# EAGLE design controller (EAGLE 6.5.0)
DATABASE: $HOME/Documents/eagle/bom-ex_database.txt
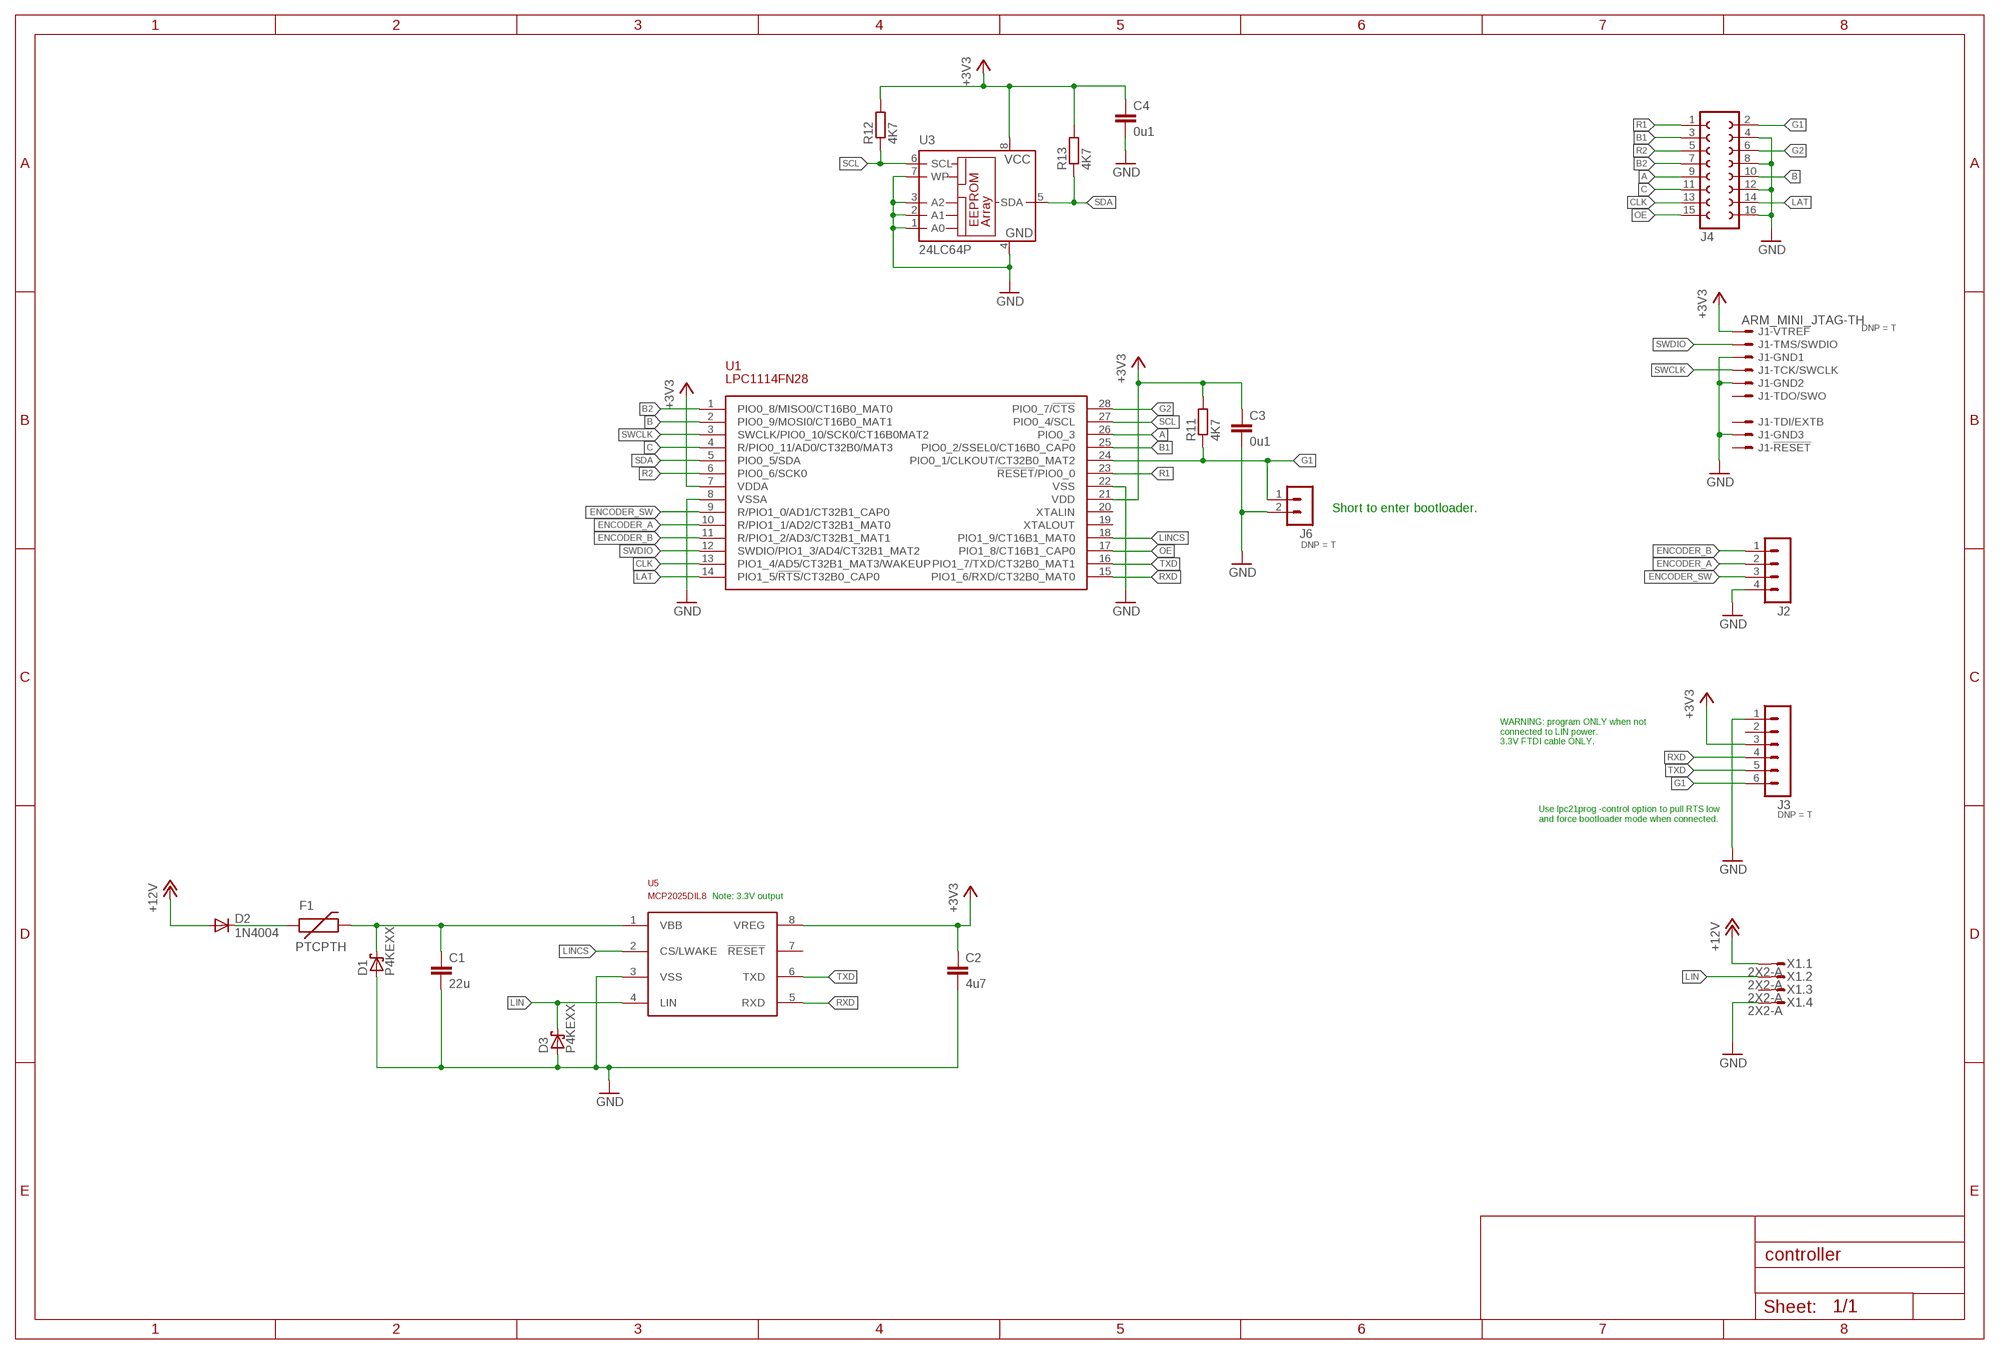
[diagram p0: schematic, sheet 1]

## Parts
C1  22u  C-EU050-024X044  [C050-024X044]
C2  4u7  C-EU050-024X044  [C050-024X044]
C3  0u1  C-EU050-024X044  [C050-024X044]
C4  0u1  C-EU050-024X044  [C050-024X044]
D1  P4KEXX  [DO41-10]
D2  1N4004  [DO41-10]
D3  P4KEXX  [DO41-10]
F1  PTCPTH  [PTC]
J1  ARM_MINI_JTAG-TH  [FTSH-105-01-XXX-DV]
J2  MA04-1  [MA04-1]
J3  MA06-1  [MA06-1]
J4  FE08-2  [FE08-2]
J6  MA02-1Y  [MA02-1Y]
R11  4K7  R-EU_0207/10  [0207/10]
R12  4K7  R-EU_0207/10  [0207/10]
R13  4K7  R-EU_0207/10  [0207/10]
U1  LPC1114FN28  [DIL28]
U3  24LC64P  [DIL8]
U5  MCP2025DIL8  [DIL8]
X1  2X2-A  [3-794618-4]

## Nets
+3V3 [power]: C2.1 C3.1 C4.1 J1.1 J3.3 R11.2 R12.2 R13.2 U1.7(VDDA) U1.21(VDD) U3.8(VCC) U5.8(VREG)
+12V [big_power]: D2.A X1.1
A: J4.9 U1.26(PIO0_3)
B: J4.10 U1.2(PIO0_9/MOSI0/CT16B0_MAT1)
B1: J4.3 U1.25(PIO0_2/SSEL0/CT16B0_CAP0)
B2: J4.7 U1.1(PIO0_8/MISO0/CT16B0_MAT0)
C: J4.11 U1.4(R/PIO0_11/AD0/CT32B0/MAT3)
CLK: J4.13 U1.13(PIO1_4/AD5/CT32B1_MAT3/WAKEUP)
ENCODER_A: J2.2 U1.10(R/PIO1_1/AD2/CT32B1_MAT0)
ENCODER_B: J2.1 U1.11(R/PIO1_2/AD3/CT32B1_MAT1)
ENCODER_SW: J2.3 U1.9(R/PIO1_0/AD1/CT32B1_CAP0)
G1: J3.6 J4.2 J6.1 R11.1 U1.24(PIO0_1/CLKOUT/CT32B0_MAT2)
G2: J4.6 U1.28(PIO0_7/!CTS)
GND [power]: C1.2 C2.2 C3.2 C4.2 D1.A D3.A J1.3 J1.5 J1.9 J2.4 J3.1 J4.4 J4.8 J4.12 J4.16 J6.2 U1.8(VSSA) U1.22(VSS) U3.1(A0) U3.2(A1) U3.3(A2) U3.4(GND) U3.7(WP) U5.3(VSS) X1.4
LAT: J4.14 U1.14(PIO1_5/!RTS!/CT32B0_CAP0)
LIN: D3.C U5.4(LIN) X1.2
LINCS: U1.18(PIO1_9/CT16B1_MAT0) U5.2(CS/LWAKE)
N$1 [big_power]: C1.1 D1.C F1.P$2 U5.1(VBB)
N$2 [big_power]: D2.C F1.P$1
OE: J4.15 U1.17(PIO1_8/CT16B1_CAP0)
R1: J4.1 U1.23(!RESET!/PIO0_0)
R2: J4.5 U1.6(PIO0_6/SCK0)
RXD: J3.4 U1.15(PIO1_6/RXD/CT32B0_MAT0) U5.5(RXD)
SCL: R12.1 U1.27(PIO0_4/SCL) U3.6(SCL)
SDA: R13.1 U1.5(PIO0_5/SDA) U3.5(SDA)
SWCLK: J1.4 U1.3(SWCLK/PIO0_10/SCK0/CT16B0MAT2)
SWDIO: J1.2 U1.12(SWDIO/PIO1_3/AD4/CT32B1_MAT2)
TXD: J3.5 U1.16(PIO1_7/TXD/CT32B0_MAT1) U5.6(TXD)
Unconnected: J1.6 J1.8 J1.10 J3.2 U1.19(XTALOUT) U1.20(XTALIN) U5.7(!RESET) X1.3

## Notes on the sheet
- Short to enter bootloader.
- WARNING: program ONLY when not
  connected to LIN power.
  3.3V FTDI cable ONLY.
- Use lpc21prog -control option to pull RTS low
  and force bootloader mode when connected.
- Note: 3.3V output

## Library data of the parts
C1 = custom:C-EU: CAPACITOR, European symbol; PARTNO: FK22X5R1E226M
C2 = custom:C-EU: CAPACITOR, European symbol; PARTNO: FK28X5R0J475K
C3 C4 = custom:C-EU: CAPACITOR, European symbol; PARTNO: FK28X7R1H104K
D1 D3 = custom:P4KEXX: DIODE transient-voltage suppressor; PARTNO: P4KE30CA
D2 = custom:1N4004: DIODE general purpose rectifier, 1 A; PARTNO: 1N4004-TP
F1 = custom:PTC: Resettable Fuse PTC Resettable Fuse. Spark Fun Electronics SKU : COM-08357; PARTNO: CMF-RL10-0
J1 = custom:ARM_MINI_JTAG: CONNECTOR wire to board 1.25 mm (.049 inch) pitch header; DNP: T; PARTNO: *
J2 = custom:MA04-1: PIN HEADER; OC_FARNELL: unknown; OC_NEWARK: unknown; PARTNO: 640454-4
J3 = custom:MA06-1: PIN HEADER; DNP: T; OC_FARNELL: unknown; OC_NEWARK: unknown; PARTNO: *
J4 = custom:FE08-2: FEMALE HEADER; OC_FARNELL: unknown; OC_NEWARK: unknown; PARTNO: PPTC082LFBN-RC
J6 = custom:MA02-1: PIN HEADER; DNP: T
R11-R13 = custom:R-EU_: RESISTOR, European symbol; PARTNO: MFR-25FBF52-4K99
U1 = custom:LPC1114FN28: ARM Cortex-M0+ in 28-pin DIP; PARTNO: LPC1114FN28/102,12
U3 = custom:24*: Serial EEPROM I2C; MF: MICROCHIP; MPN: 24LC64-I/P; OC_FARNELL: 9758054; OC_NEWARK: 62K0584; PARTNO: 24LC64-I/P
U5 = custom:MCP2025: LIN Transceiver with Voltage Regulator; PARTNO: MCP2025-330E/P
X1 = custom:2X2; PARTNO: 3-794618-4

## Net classes
0 default: width 0.254 mm, drill 0.508 mm
1 power: width 0.635 mm, drill 0.508 mm
2 big_power: width 1.27 mm, clearance 0.508 mm

## Board
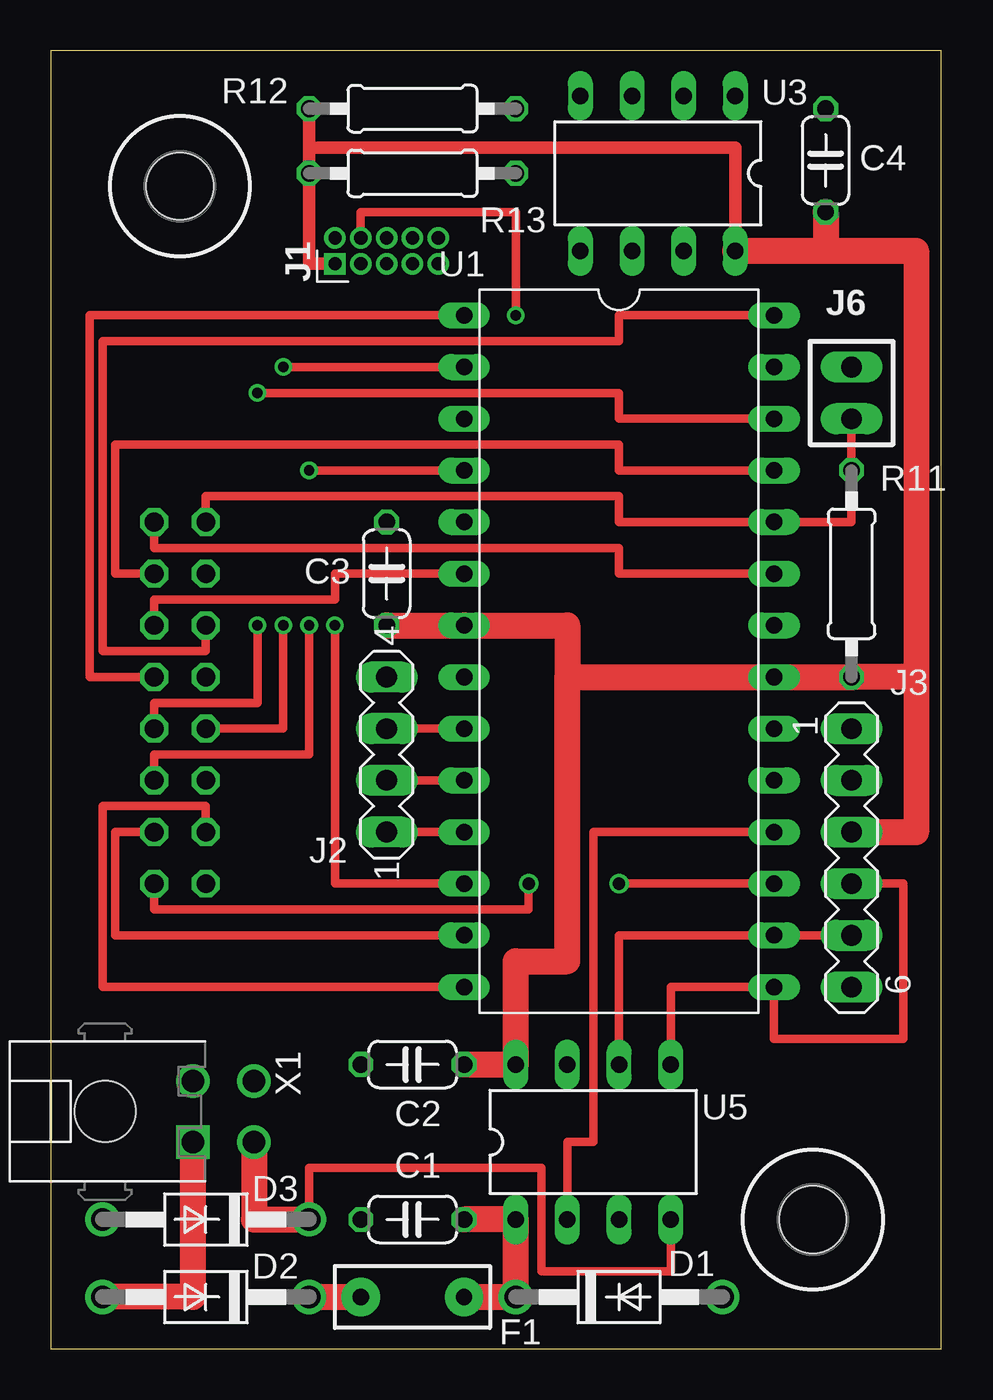
[diagram p1: board, top side]
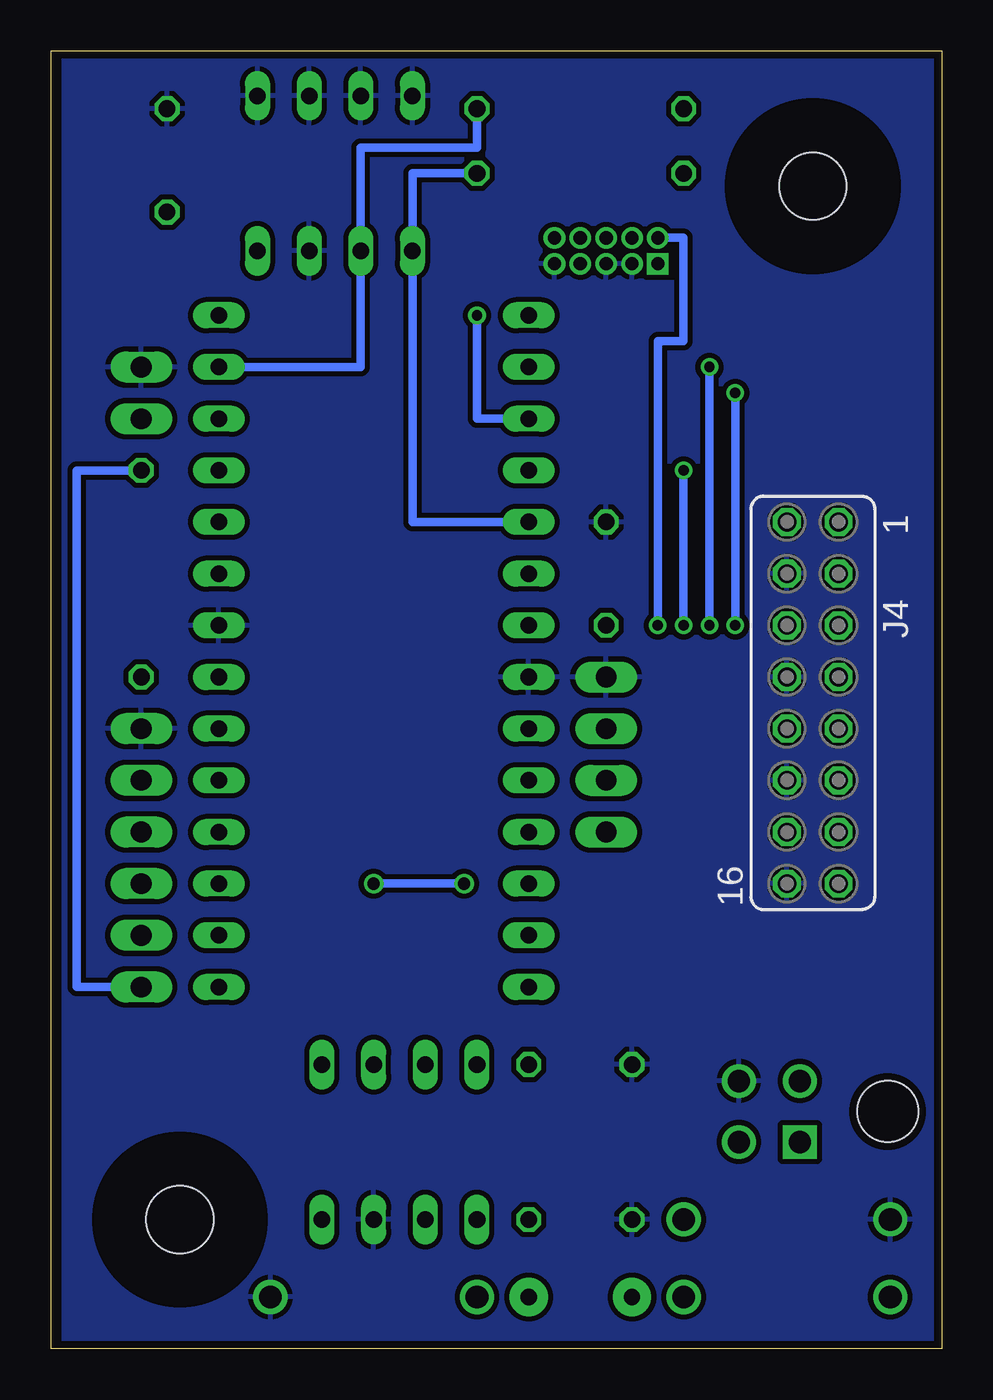
[diagram p2: board, bottom side, seen from below]

Size 43.8 x 63.8 mm. Coordinates in mm from the lower left corner, seen from the top.
Outline: 0,0 43.8,0 43.8,63.8 0,63.8 0,0
Copper layers (1*16): Top 0.0356mm / dielectric 1.5011mm / Bottom 0.0356mm
Design rules "LaenPCBOrder": minimum track width 6mil, minimum drill 13mil, track to track 6mil, track to pad 6mil, pad to pad 6mil, via to via 6mil, smd to smd 6mil, copper to edge 15mil, drill to drill 6mil, minimum pad ring 7mil, minimum via ring 7mil, stop-mask expansion 3mil, vias tented up to drill 0mil, thermal gap 10mil

### Footprints (pad centres in the part's own frame; a part is rotated, then mirrored left to right if it is on the bottom)
C050-024X044 = drill 0.813 octagon: 1 -2.54,0; 2 2.54,0
DO41-10 = drill 1.118: A 5.08,0; C -5.08,0
PTC = drill 0.8 pad 1.88: P$1 -2.54,0; P$2 2.54,0
FTSH-105-01-XXX-DV = drill 0.65 pad 1.06 square: 1 0,0 | drill 0.65 pad 1.06: 2 0,1.27; 3 1.27,0; 4 1.27,1.27; 5 2.54,0; 6 2.54,1.27; 7 3.81,0; 8 3.81,1.27; 9 5.08,0; 10 5.08,1.27
MA04-1 = drill 1.016 long: 1 -3.81,0; 2 -1.27,0; 3 1.27,0; 4 3.81,0
MA06-1 = drill 1.016 long: 1 -6.35,0; 2 -3.81,0; 3 -1.27,0; 4 1.27,0; 5 3.81,0; 6 6.35,0
FE08-2 = drill 0.914 octagon: 1 -8.89,1.27; 2 -8.89,-1.27; 3 -6.35,1.27; 4 -6.35,-1.27; 5 -3.81,1.27; 6 -3.81,-1.27; 7 -1.27,1.27; 8 -1.27,-1.27; 9 1.27,1.27; 10 1.27,-1.27; 11 3.81,1.27; 12 3.81,-1.27; 13 6.35,1.27; 14 6.35,-1.27; 15 8.89,1.27; 16 8.89,-1.27
MA02-1Y = drill 1.016 long: 1 -1.27,0; 2 1.27,0
0207/10 = drill 0.813 octagon: 1 -5.08,0; 2 5.08,0
DIL28 = drill 0.813 pad 1.27 long: 1 -16.51,-7.62; 2 -13.97,-7.62; 3 -11.43,-7.62; 4 -8.89,-7.62; 5 -6.35,-7.62; 6 -3.81,-7.62; 7 -1.27,-7.62; 8 1.27,-7.62; 9 3.81,-7.62; 10 6.35,-7.62; 11 8.89,-7.62; 12 11.43,-7.62; 13 13.97,-7.62; 14 16.51,-7.62; 15 16.51,7.62; 16 13.97,7.62; 17 11.43,7.62; 18 8.89,7.62; 19 6.35,7.62; 20 3.81,7.62; 21 1.27,7.62; 22 -1.27,7.62; 23 -3.81,7.62; 24 -6.35,7.62; 25 -8.89,7.62; 26 -11.43,7.62; 27 -13.97,7.62; 28 -16.51,7.62
DIL8 = drill 0.813 long: 1 -3.81,-3.81; 2 -1.27,-3.81; 3 1.27,-3.81; 4 3.81,-3.81; 5 3.81,3.81; 6 1.27,3.81; 7 -1.27,3.81; 8 -3.81,3.81
3,3 = hole 3.3: 0,0
3-794618-4 = drill 1.1 square: 1 0,0 | drill 1.1: 2 0,3; 3 -3,0; 4 -3,3 | hole 3: -1.5,-4.32

### Placement (x,y rotation side)
C1  17.78,6.35 180 top
C2  17.78,13.97 180 top
C3  16.51,38.1 90 top
C4  38.1,58.42 90 top
D1  27.94,2.54 0 top
D2  7.62,2.54 180 top
D3  7.62,6.35 180 top
F1  17.78,2.54 0 top
J1  13.97,53.34 0 top
J2  16.51,29.21 90 top
J3  39.37,24.13 270 top
J4  6.35,31.75 270 bottom
J6  39.37,46.99 90 top
R11  39.37,38.1 270 top
R12  17.78,60.96 180 top
R13  17.78,57.78 180 top
U1  27.94,34.29 270 top
U3  29.84,57.78 180 top
U5  26.67,10.16 0 top
U$1  [3,3]  6.35,57.15 0 top
U$2  [3,3]  37.47,6.35 0 top
X1  6.99,10.16 270 top

### Tracks (layer width: path | path; a pad name or v marks a point on that pad's centre or on a via)
+3V3
  Top 0.61: R12.2 12.7,59.05 | 12.7,59.05 R13.2 12.7,53.34 J1.1 | U3.8 33.66,59.05 12.7,59.05
  Top 1.27: 25.4,33.02 25.4,35.56 U1.7 C3.1 | 25.4,33.02 U1.21 R11.2 42.55,33.02 | U3.8 38.1,53.98 | 38.1,53.98 42.55,53.98 42.55,33.02 | C4.1 38.1,53.98 | 42.55,33.02 42.55,25.4 J3.3 | 25.4,33.02 25.4,19.05 22.86,19.05 U5.8 C2.1
+12V
  Top 1.27: X1.1 6.99,2.54 D2.A
A  (via drill 0.51)
  Top 0.406: J4.9 5.08,31.75 10.16,31.75 v10.16,35.56 | v10.16,46.99 27.94,46.99 27.94,45.72 U1.26
  Bottom 0.406: v10.16,35.56 v10.16,46.99
B  (via drill 0.51)
  Top 0.406: J4.10 11.43,30.48 v11.43,35.56 | v11.43,48.26 U1.2
  Bottom 0.406: v11.43,35.56 v11.43,48.26
B1
  Top 0.406: J4.3 3.17,38.1 3.17,44.45 27.94,44.45 27.94,43.18 U1.25
B2
  Top 0.406: J4.7 1.91,33.02 1.91,50.8 U1.1
C  (via drill 0.51)
  Top 0.406: J4.11 5.08,29.21 12.7,29.21 v12.7,35.56 | v12.7,43.18 U1.4
  Bottom 0.406: v12.7,35.56 v12.7,43.18
CLK
  Top 0.406: U1.13 3.17,20.32 3.17,25.4 J4.13
ENCODER_A
  Top 0.406: J2.2 U1.10
ENCODER_B
  Top 0.406: J2.1 U1.11
ENCODER_SW
  Top 0.406: J2.3 U1.9
G1
  Top 0.406: J4.2 7.62,41.91 27.94,41.91 27.94,40.64 U1.24 39.37,40.64 R11.1 J6.1
  Bottom 0.406: J3.6 42.55,17.78 42.55,43.18 R11.1
G2
  Top 0.406: J4.6 7.62,34.29 2.54,34.29 2.54,49.53 27.94,49.53 27.94,50.8 U1.28
GND
  pour Bottom (isolate 0.254): 0,0 0,63.5 43.18,63.5 43.18,0
LAT
  Top 0.406: U1.14 2.54,17.78 2.54,26.67 7.62,26.67 J4.14
LIN
  Top 0.406: U5.4 30.48,3.81 24.13,3.81 24.13,8.89 12.7,8.89 D3.C
  Top 1.27: X1.2 9.98,6.35 D3.C
LINCS
  Top 0.406: U5.2 25.4,10.16 26.67,10.16 26.67,25.4 U1.18
N$1
  Top 1.27: F1.P$2 D1.C U5.1 C1.1
N$2
  Top 1.27: D2.C F1.P$1
OE  (via drill 0.6)
  Top 0.406: v23.5,22.86 23.5,21.59 5.08,21.59 J4.15 | v27.94,22.86 U1.17
  Bottom 0.406: v23.5,22.86 v27.94,22.86
R1
  Top 0.406: J4.1 5.08,39.37 27.94,39.37 27.94,38.1 U1.23
R2
  Top 0.406: J4.5 5.08,36.83 13.97,36.83 13.97,38.1 U1.6
RXD
  Top 0.406: U5.5 30.48,17.78 U1.15 35.56,15.24 41.91,15.24 41.91,22.86 J3.4
SCL
  Bottom 0.406: U1.27 28.57,48.26 U3.6 28.57,59.05 22.86,59.05 R12.1
SDA
  Bottom 0.406: U1.5 26.04,40.64 U3.5 26.04,57.78 R13.1
SWCLK  (via drill 0.51)
  Top 0.406: v22.86,50.8 22.86,55.88 15.24,55.88 J1.4
  Bottom 0.406: U1.3 22.86,45.72 v22.86,50.8
SWDIO  (via drill 0.51)
  Top 0.406: U1.12 13.97,22.86 v13.97,35.56
  Bottom 0.406: v13.97,35.56 13.97,49.53 12.7,49.53 12.7,54.61 J1.2
TXD
  Top 0.406: U5.6 27.94,20.32 U1.16 J3.5